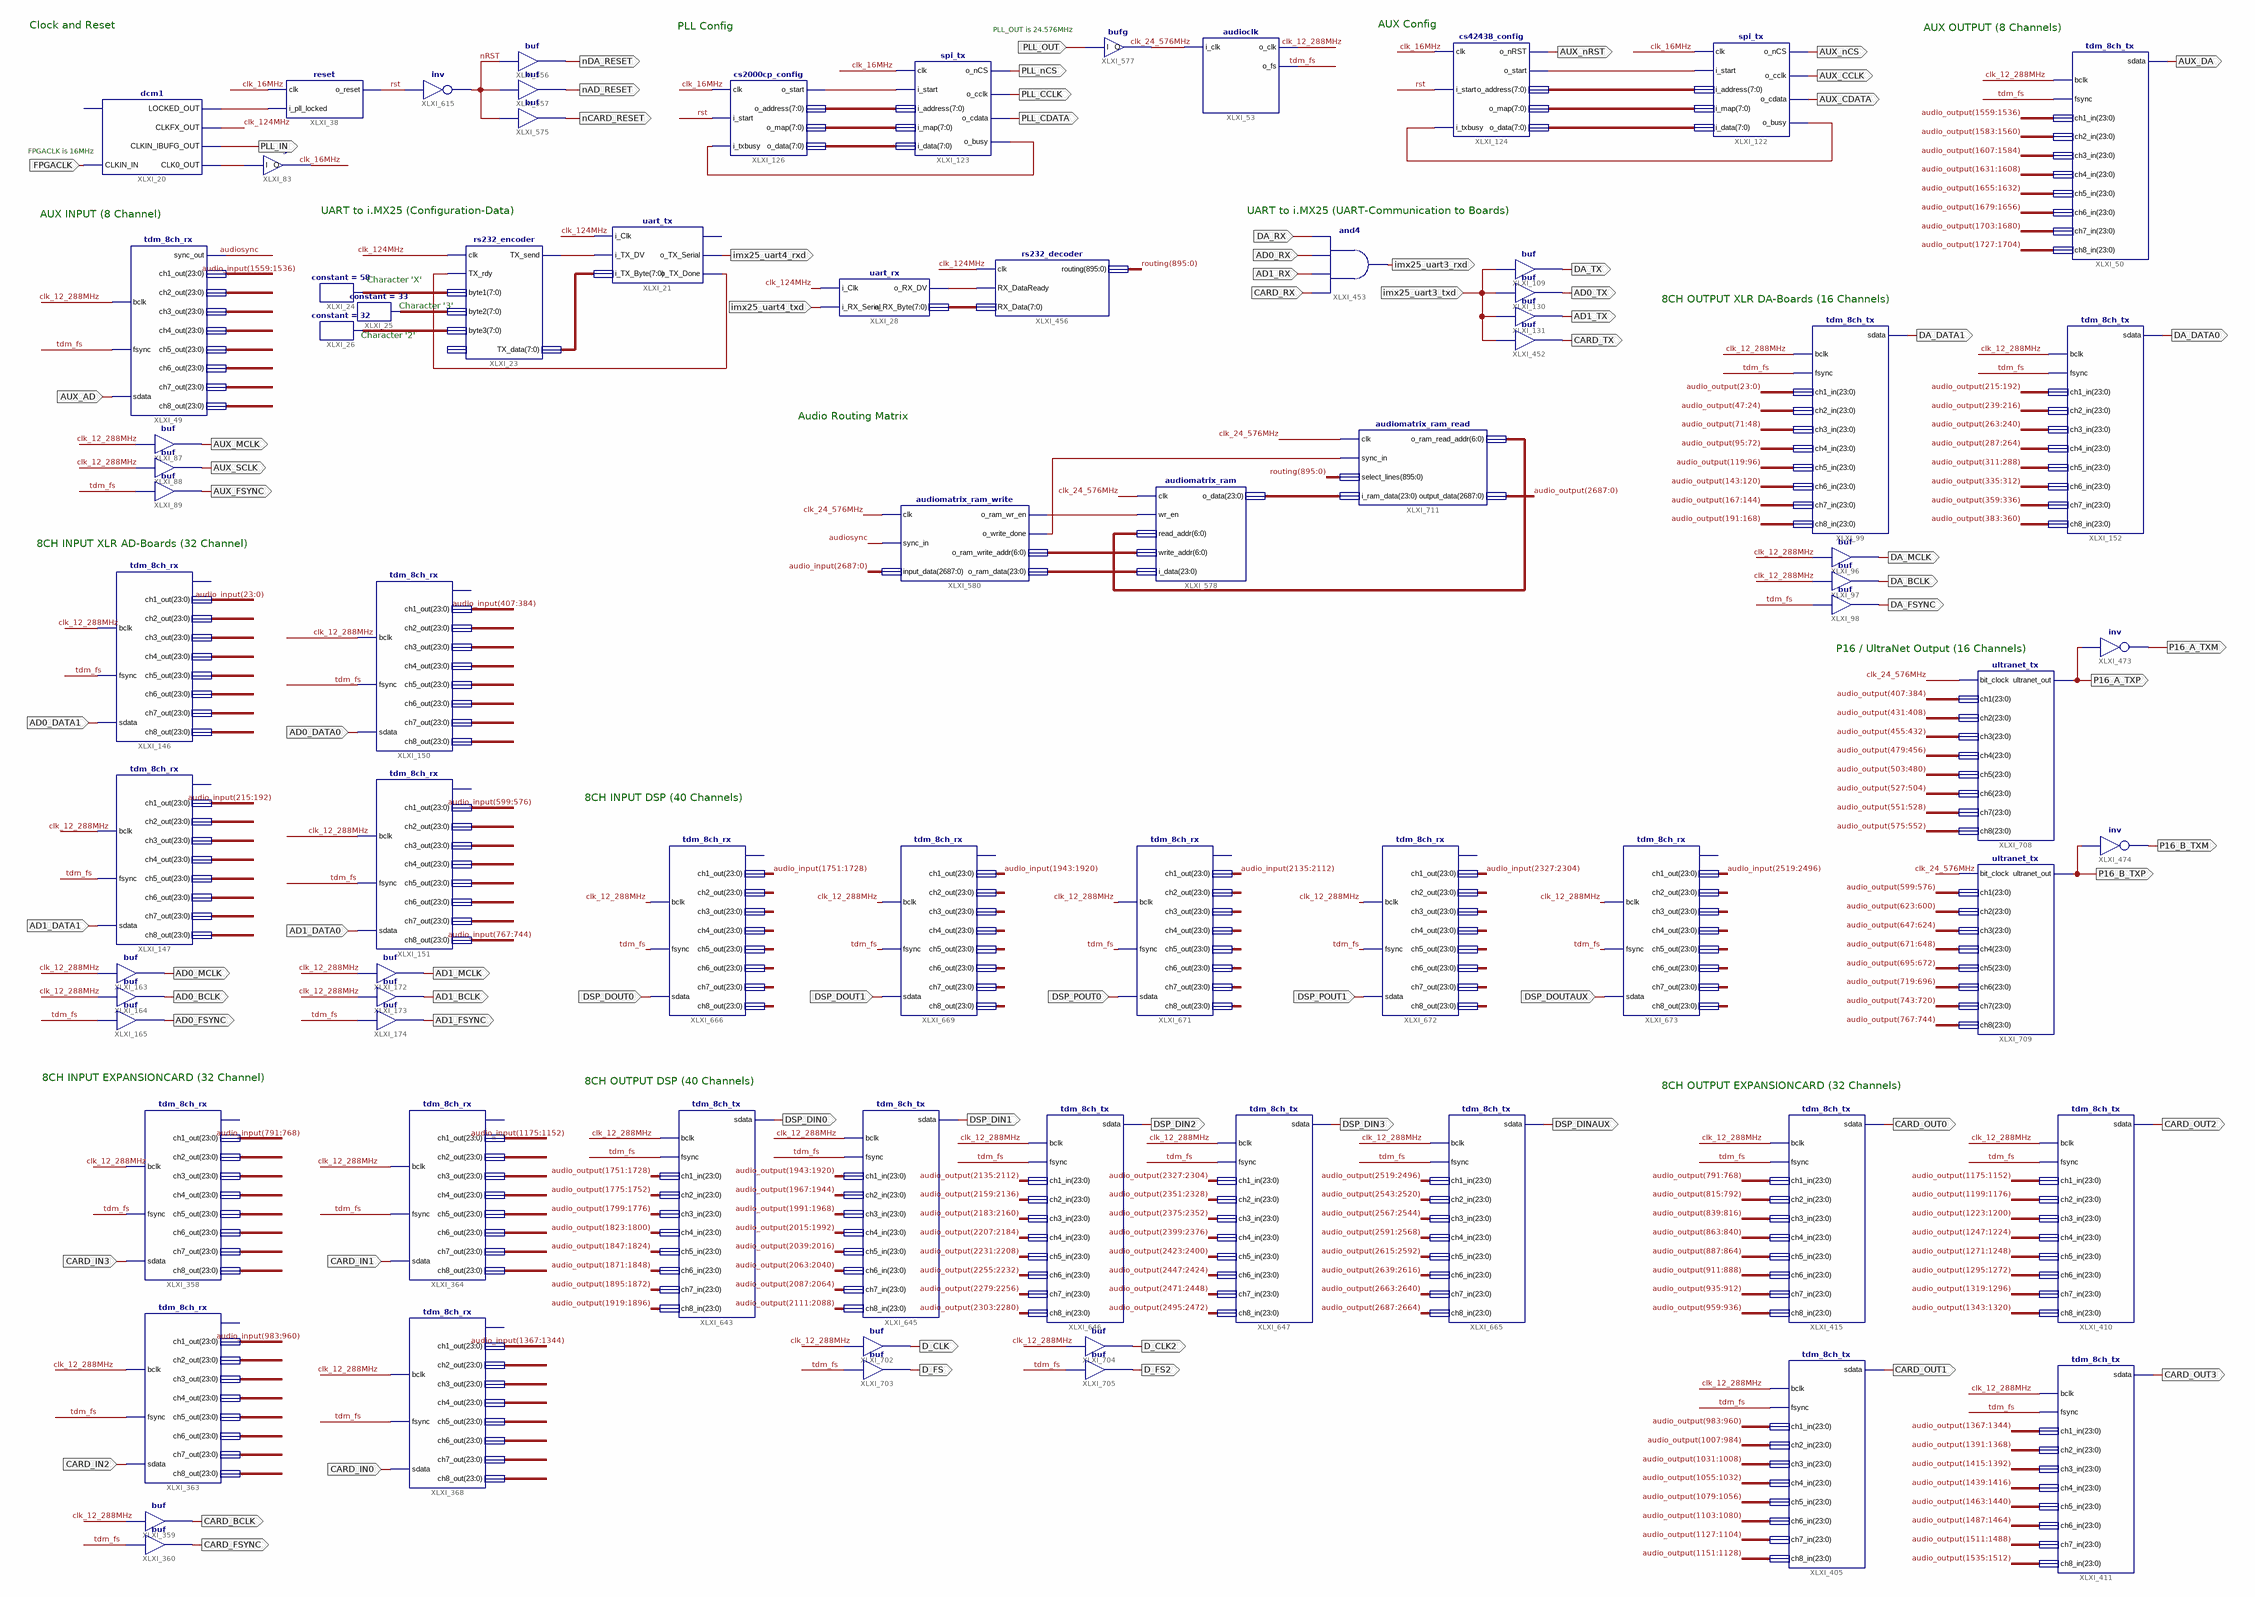
[diagram p0: schematic sheet 1]
// Xilinx ISE schematic main.sch (spartan3a) as structural Verilog: 76 symbols, 73 ports
module main (
  input  FPGACLK,
  input  PLL_OUT,
  input  CARD_IN3,
  input  CARD_IN2,
  input  CARD_IN1,
  input  CARD_IN0,
  input  AD0_DATA1,
  input  AD1_DATA1,
  input  AD0_DATA0,
  input  AD1_DATA0,
  input  imx25_uart4_txd,
  input  DA_RX,
  input  AD0_RX,
  input  AD1_RX,
  input  CARD_RX,
  input  imx25_uart3_txd,
  input  AUX_AD,
  input  DSP_DOUTAUX,
  input  DSP_DOUT0,
  input  DSP_DOUT1,
  input  DSP_POUT0,
  input  DSP_POUT1,
  output PLL_IN,
  output nDA_RESET,
  output nAD_RESET,
  output nCARD_RESET,
  output CARD_OUT0,
  output CARD_OUT1,
  output CARD_OUT2,
  output CARD_OUT3,
  output P16_A_TXP,
  output P16_A_TXM,
  output P16_B_TXP,
  output P16_B_TXM,
  output DA_MCLK,
  output DA_BCLK,
  output DA_FSYNC,
  output DA_DATA1,
  output DA_DATA0,
  output PLL_nCS,
  output PLL_CDATA,
  output PLL_CCLK,
  output AUX_nRST,
  output AUX_nCS,
  output AUX_CCLK,
  output AUX_CDATA,
  output AUX_DA,
  output CARD_BCLK,
  output CARD_FSYNC,
  output AD0_MCLK,
  output AD0_BCLK,
  output AD0_FSYNC,
  output AD1_MCLK,
  output AD1_BCLK,
  output AD1_FSYNC,
  output imx25_uart4_rxd,
  output imx25_uart3_rxd,
  output DA_TX,
  output AD0_TX,
  output AD1_TX,
  output CARD_TX,
  output AUX_MCLK,
  output AUX_SCLK,
  output AUX_FSYNC,
  output DSP_DIN0,
  output DSP_DIN1,
  output DSP_DIN2,
  output DSP_DIN3,
  output DSP_DINAUX,
  output D_CLK,
  output D_FS,
  output D_CLK2,
  output D_FS2
);

  wire audiosync, clk_12_288MHz, clk_16MHz, clk_24_576MHz, clk_124MHz, nRST, rst, tdm_fs, XLXN_50, XLXN_54,
       XLXN_63, XLXN_70, XLXN_222, XLXN_226, XLXN_330, XLXN_346, XLXN_1898, XLXN_2357, XLXN_2487;
  wire [6:0] XLXN_1973, XLXN_2328;
  wire [7:0] XLXN_52, XLXN_55, XLXN_56, XLXN_57, XLXN_62, XLXN_67, XLXN_68, XLXN_69, XLXN_223, XLXN_224,
       XLXN_225;
  wire [23:0] XLXN_1974, XLXN_2309;
  wire [895:0] routing;
  wire [2687:0] audio_input, audio_output;

  dcm1 XLXI_20 (
    .CLKIN_IN(FPGACLK), .LOCKED_OUT(XLXN_2487), .CLKFX_OUT(clk_124MHz), .CLKIN_IBUFG_OUT(PLL_IN),
    .CLK0_OUT(XLXN_330));  // open: RST_IN
  bufg XLXI_83 (.I(XLXN_330), .O(clk_16MHz));
  not XLXI_615 (nRST, rst);
  buf XLXI_556 (nDA_RESET, nRST);
  buf XLXI_557 (nAD_RESET, nRST);
  buf XLXI_575 (nCARD_RESET, nRST);
  tdm_8ch_tx XLXI_415 (
    .bclk(clk_12_288MHz), .fsync(tdm_fs), .ch1_in(audio_output[791:768]), .ch2_in(audio_output[815:792]),
    .ch3_in(audio_output[839:816]), .ch4_in(audio_output[863:840]), .ch5_in(audio_output[887:864]),
    .ch6_in(audio_output[911:888]), .ch7_in(audio_output[935:912]), .ch8_in(audio_output[959:936]),
    .sdata(CARD_OUT0));
  tdm_8ch_tx XLXI_405 (
    .bclk(clk_12_288MHz), .fsync(tdm_fs), .ch1_in(audio_output[983:960]), .ch2_in(audio_output[1007:984]),
    .ch3_in(audio_output[1031:1008]), .ch4_in(audio_output[1055:1032]), .ch5_in(audio_output[1079:1056]),
    .ch6_in(audio_output[1103:1080]), .ch7_in(audio_output[1127:1104]), .ch8_in(audio_output[1151:1128]),
    .sdata(CARD_OUT1));
  tdm_8ch_tx XLXI_410 (
    .bclk(clk_12_288MHz), .fsync(tdm_fs), .ch1_in(audio_output[1175:1152]), .ch2_in(audio_output[1199:1176]),
    .ch3_in(audio_output[1223:1200]), .ch4_in(audio_output[1247:1224]), .ch5_in(audio_output[1271:1248]),
    .ch6_in(audio_output[1295:1272]), .ch7_in(audio_output[1319:1296]), .ch8_in(audio_output[1343:1320]),
    .sdata(CARD_OUT2));
  tdm_8ch_tx XLXI_411 (
    .bclk(clk_12_288MHz), .fsync(tdm_fs), .ch1_in(audio_output[1367:1344]), .ch2_in(audio_output[1391:1368]),
    .ch3_in(audio_output[1415:1392]), .ch4_in(audio_output[1439:1416]), .ch5_in(audio_output[1463:1440]),
    .ch6_in(audio_output[1487:1464]), .ch7_in(audio_output[1511:1488]), .ch8_in(audio_output[1535:1512]),
    .sdata(CARD_OUT3));
  not XLXI_473 (P16_A_TXM, P16_A_TXP);
  not XLXI_474 (P16_B_TXM, P16_B_TXP);
  tdm_8ch_tx XLXI_99 (
    .bclk(clk_12_288MHz), .fsync(tdm_fs), .ch1_in(audio_output[23:0]), .ch2_in(audio_output[47:24]),
    .ch3_in(audio_output[71:48]), .ch4_in(audio_output[95:72]), .ch5_in(audio_output[119:96]),
    .ch6_in(audio_output[143:120]), .ch7_in(audio_output[167:144]), .ch8_in(audio_output[191:168]),
    .sdata(DA_DATA1));
  tdm_8ch_tx XLXI_152 (
    .bclk(clk_12_288MHz), .fsync(tdm_fs), .ch1_in(audio_output[215:192]), .ch2_in(audio_output[239:216]),
    .ch3_in(audio_output[263:240]), .ch4_in(audio_output[287:264]), .ch5_in(audio_output[311:288]),
    .ch6_in(audio_output[335:312]), .ch7_in(audio_output[359:336]), .ch8_in(audio_output[383:360]),
    .sdata(DA_DATA0));
  buf XLXI_96 (DA_MCLK, clk_12_288MHz);
  buf XLXI_97 (DA_BCLK, clk_12_288MHz);
  buf XLXI_98 (DA_FSYNC, tdm_fs);
  reset XLXI_38 (.clk(clk_16MHz), .i_pll_locked(XLXN_2487), .o_reset(rst));
  cs2000cp_config XLXI_126 (
    .clk(clk_16MHz), .i_start(rst), .i_txbusy(XLXN_226), .o_start(XLXN_222), .o_address(XLXN_223),
    .o_map(XLXN_224), .o_data(XLXN_225));
  spi_tx XLXI_123 (
    .clk(clk_16MHz), .i_start(XLXN_222), .i_address(XLXN_223), .i_map(XLXN_224), .i_data(XLXN_225),
    .o_nCS(PLL_nCS), .o_cclk(PLL_CCLK), .o_cdata(PLL_CDATA), .o_busy(XLXN_226));
  bufg XLXI_577 (.I(PLL_OUT), .O(clk_24_576MHz));
  audioclk XLXI_53 (.i_clk(clk_24_576MHz), .o_clk(clk_12_288MHz), .o_fs(tdm_fs));
  spi_tx XLXI_122 (
    .clk(clk_16MHz), .i_start(XLXN_346), .i_address(XLXN_67), .i_map(XLXN_68), .i_data(XLXN_69),
    .o_nCS(AUX_nCS), .o_cclk(AUX_CCLK), .o_cdata(AUX_CDATA), .o_busy(XLXN_70));
  cs42438_config XLXI_124 (
    .clk(clk_16MHz), .i_start(rst), .i_txbusy(XLXN_70), .o_nRST(AUX_nRST), .o_start(XLXN_346),
    .o_address(XLXN_67), .o_map(XLXN_68), .o_data(XLXN_69));
  tdm_8ch_tx XLXI_50 (
    .bclk(clk_12_288MHz), .fsync(tdm_fs), .ch1_in(audio_output[1559:1536]), .ch2_in(audio_output[1583:1560]),
    .ch3_in(audio_output[1607:1584]), .ch4_in(audio_output[1631:1608]), .ch5_in(audio_output[1655:1632]),
    .ch6_in(audio_output[1679:1656]), .ch7_in(audio_output[1703:1680]), .ch8_in(audio_output[1727:1704]),
    .sdata(AUX_DA));
  tdm_8ch_rx XLXI_363 (
    .bclk(clk_12_288MHz), .fsync(tdm_fs), .sdata(CARD_IN2), .ch1_out(audio_input[983:960]),
    .ch2_out(audio_input[1007:984]), .ch3_out(audio_input[1031:1008]), .ch4_out(audio_input[1055:1032]),
    .ch5_out(audio_input[1079:1056]), .ch6_out(audio_input[1103:1080]), .ch7_out(audio_input[1127:1104]),
    .ch8_out(audio_input[1151:1128]));  // open: sync_out
  tdm_8ch_rx XLXI_358 (
    .bclk(clk_12_288MHz), .fsync(tdm_fs), .sdata(CARD_IN3), .ch1_out(audio_input[791:768]),
    .ch2_out(audio_input[815:792]), .ch3_out(audio_input[839:816]), .ch4_out(audio_input[863:840]),
    .ch5_out(audio_input[887:864]), .ch6_out(audio_input[911:888]), .ch7_out(audio_input[935:912]),
    .ch8_out(audio_input[959:936]));  // open: sync_out
  tdm_8ch_rx XLXI_364 (
    .bclk(clk_12_288MHz), .fsync(tdm_fs), .sdata(CARD_IN1), .ch1_out(audio_input[1175:1152]),
    .ch2_out(audio_input[1199:1176]), .ch3_out(audio_input[1223:1200]), .ch4_out(audio_input[1247:1224]),
    .ch5_out(audio_input[1271:1248]), .ch6_out(audio_input[1295:1272]), .ch7_out(audio_input[1319:1296]),
    .ch8_out(audio_input[1343:1320]));  // open: sync_out
  tdm_8ch_rx XLXI_368 (
    .bclk(clk_12_288MHz), .fsync(tdm_fs), .sdata(CARD_IN0), .ch1_out(audio_input[1367:1344]),
    .ch2_out(audio_input[1391:1368]), .ch3_out(audio_input[1415:1392]), .ch4_out(audio_input[1439:1416]),
    .ch5_out(audio_input[1463:1440]), .ch6_out(audio_input[1487:1464]), .ch7_out(audio_input[1511:1488]),
    .ch8_out(audio_input[1535:1512]));  // open: sync_out
  buf XLXI_359 (CARD_BCLK, clk_12_288MHz);
  buf XLXI_360 (CARD_FSYNC, tdm_fs);
  tdm_8ch_rx XLXI_146 (
    .bclk(clk_12_288MHz), .fsync(tdm_fs), .sdata(AD0_DATA1), .ch1_out(audio_input[23:0]),
    .ch2_out(audio_input[47:24]), .ch3_out(audio_input[71:48]), .ch4_out(audio_input[95:72]),
    .ch5_out(audio_input[119:96]), .ch6_out(audio_input[143:120]), .ch7_out(audio_input[167:144]),
    .ch8_out(audio_input[191:168]));  // open: sync_out
  tdm_8ch_rx XLXI_147 (
    .bclk(clk_12_288MHz), .fsync(tdm_fs), .sdata(AD1_DATA1), .ch1_out(audio_input[215:192]),
    .ch2_out(audio_input[239:216]), .ch3_out(audio_input[263:240]), .ch4_out(audio_input[287:264]),
    .ch5_out(audio_input[311:288]), .ch6_out(audio_input[335:312]), .ch7_out(audio_input[359:336]),
    .ch8_out(audio_input[383:360]));  // open: sync_out
  tdm_8ch_rx XLXI_150 (
    .bclk(clk_12_288MHz), .fsync(tdm_fs), .sdata(AD0_DATA0), .ch1_out(audio_input[407:384]),
    .ch2_out(audio_input[431:408]), .ch3_out(audio_input[455:432]), .ch4_out(audio_input[479:456]),
    .ch5_out(audio_input[503:480]), .ch6_out(audio_input[527:504]), .ch7_out(audio_input[551:528]),
    .ch8_out(audio_input[575:552]));  // open: sync_out
  tdm_8ch_rx XLXI_151 (
    .bclk(clk_12_288MHz), .fsync(tdm_fs), .sdata(AD1_DATA0), .ch1_out(audio_input[599:576]),
    .ch2_out(audio_input[623:600]), .ch3_out(audio_input[647:624]), .ch4_out(audio_input[671:648]),
    .ch5_out(audio_input[695:672]), .ch6_out(audio_input[719:696]), .ch7_out(audio_input[743:720]),
    .ch8_out(audio_input[767:744]));  // open: sync_out
  buf XLXI_163 (AD0_MCLK, clk_12_288MHz);
  buf XLXI_164 (AD0_BCLK, clk_12_288MHz);
  buf XLXI_165 (AD0_FSYNC, tdm_fs);
  buf XLXI_172 (AD1_MCLK, clk_12_288MHz);
  buf XLXI_173 (AD1_BCLK, clk_12_288MHz);
  buf XLXI_174 (AD1_FSYNC, tdm_fs);
  rs232_encoder XLXI_23 (
    .clk(clk_124MHz), .TX_rdy(XLXN_54), .byte1(XLXN_55), .byte2(XLXN_56), .byte3(XLXN_57), .TX_send(XLXN_50),
    .TX_data(XLXN_52));  // open: byte4
  uart_tx XLXI_21 (
    .i_Clk(clk_124MHz), .i_TX_DV(XLXN_50), .i_TX_Byte(XLXN_52), .o_TX_Serial(imx25_uart4_rxd),
    .o_TX_Done(XLXN_54));  // open: o_TX_Active
  constant #(.CValue("33")) XLXI_25 (.O(XLXN_56));
  constant #(.CValue("58")) XLXI_24 (.O(XLXN_55));
  constant #(.CValue("32")) XLXI_26 (.O(XLXN_57));
  uart_rx XLXI_28 (.i_Clk(clk_124MHz), .i_RX_Serial(imx25_uart4_txd), .o_RX_DV(XLXN_63), .o_RX_Byte(XLXN_62));
  rs232_decoder XLXI_456 (.clk(clk_124MHz), .RX_DataReady(XLXN_63), .RX_Data(XLXN_62), .routing(routing));
  and XLXI_453 (imx25_uart3_rxd, CARD_RX, AD1_RX, AD0_RX, DA_RX);
  buf XLXI_130 (AD0_TX, imx25_uart3_txd);
  buf XLXI_131 (AD1_TX, imx25_uart3_txd);
  buf XLXI_109 (DA_TX, imx25_uart3_txd);
  buf XLXI_452 (CARD_TX, imx25_uart3_txd);
  tdm_8ch_rx XLXI_49 (
    .bclk(clk_12_288MHz), .fsync(tdm_fs), .sdata(AUX_AD), .sync_out(audiosync),
    .ch1_out(audio_input[1559:1536]), .ch2_out(audio_input[1583:1560]), .ch3_out(audio_input[1607:1584]),
    .ch4_out(audio_input[1631:1608]), .ch5_out(audio_input[1655:1632]), .ch6_out(audio_input[1679:1656]),
    .ch7_out(audio_input[1703:1680]), .ch8_out(audio_input[1727:1704]));
  buf XLXI_87 (AUX_MCLK, clk_12_288MHz);
  buf XLXI_88 (AUX_SCLK, clk_12_288MHz);
  buf XLXI_89 (AUX_FSYNC, tdm_fs);
  tdm_8ch_rx XLXI_673 (
    .bclk(clk_12_288MHz), .fsync(tdm_fs), .sdata(DSP_DOUTAUX), .ch1_out(audio_input[2519:2496]),
    .ch2_out(audio_input[2543:2520]), .ch3_out(audio_input[2567:2544]), .ch4_out(audio_input[2591:2568]),
    .ch5_out(audio_input[2615:2592]), .ch6_out(audio_input[2639:2616]), .ch7_out(audio_input[2663:2640]),
    .ch8_out(audio_input[2687:2664]));  // open: sync_out
  tdm_8ch_rx XLXI_666 (
    .bclk(clk_12_288MHz), .fsync(tdm_fs), .sdata(DSP_DOUT0), .ch1_out(audio_input[1751:1728]),
    .ch2_out(audio_input[1775:1752]), .ch3_out(audio_input[1799:1776]), .ch4_out(audio_input[1823:1800]),
    .ch5_out(audio_input[1847:1824]), .ch6_out(audio_input[1871:1848]), .ch7_out(audio_input[1895:1872]),
    .ch8_out(audio_input[1919:1896]));  // open: sync_out
  tdm_8ch_rx XLXI_669 (
    .bclk(clk_12_288MHz), .fsync(tdm_fs), .sdata(DSP_DOUT1), .ch1_out(audio_input[1943:1920]),
    .ch2_out(audio_input[1967:1944]), .ch3_out(audio_input[1991:1968]), .ch4_out(audio_input[2015:1992]),
    .ch5_out(audio_input[2039:2016]), .ch6_out(audio_input[2063:2040]), .ch7_out(audio_input[2087:2064]),
    .ch8_out(audio_input[2111:2088]));  // open: sync_out
  tdm_8ch_rx XLXI_671 (
    .bclk(clk_12_288MHz), .fsync(tdm_fs), .sdata(DSP_POUT0), .ch1_out(audio_input[2135:2112]),
    .ch2_out(audio_input[2159:2136]), .ch3_out(audio_input[2183:2160]), .ch4_out(audio_input[2207:2184]),
    .ch5_out(audio_input[2231:2208]), .ch6_out(audio_input[2255:2232]), .ch7_out(audio_input[2279:2256]),
    .ch8_out(audio_input[2303:2280]));  // open: sync_out
  tdm_8ch_rx XLXI_672 (
    .bclk(clk_12_288MHz), .fsync(tdm_fs), .sdata(DSP_POUT1), .ch1_out(audio_input[2327:2304]),
    .ch2_out(audio_input[2351:2328]), .ch3_out(audio_input[2375:2352]), .ch4_out(audio_input[2399:2376]),
    .ch5_out(audio_input[2423:2400]), .ch6_out(audio_input[2447:2424]), .ch7_out(audio_input[2471:2448]),
    .ch8_out(audio_input[2495:2472]));  // open: sync_out
  tdm_8ch_tx XLXI_643 (
    .bclk(clk_12_288MHz), .fsync(tdm_fs), .ch1_in(audio_output[1751:1728]), .ch2_in(audio_output[1775:1752]),
    .ch3_in(audio_output[1799:1776]), .ch4_in(audio_output[1823:1800]), .ch5_in(audio_output[1847:1824]),
    .ch6_in(audio_output[1871:1848]), .ch7_in(audio_output[1895:1872]), .ch8_in(audio_output[1919:1896]),
    .sdata(DSP_DIN0));
  tdm_8ch_tx XLXI_645 (
    .bclk(clk_12_288MHz), .fsync(tdm_fs), .ch1_in(audio_output[1943:1920]), .ch2_in(audio_output[1967:1944]),
    .ch3_in(audio_output[1991:1968]), .ch4_in(audio_output[2015:1992]), .ch5_in(audio_output[2039:2016]),
    .ch6_in(audio_output[2063:2040]), .ch7_in(audio_output[2087:2064]), .ch8_in(audio_output[2111:2088]),
    .sdata(DSP_DIN1));
  tdm_8ch_tx XLXI_646 (
    .bclk(clk_12_288MHz), .fsync(tdm_fs), .ch1_in(audio_output[2135:2112]), .ch2_in(audio_output[2159:2136]),
    .ch3_in(audio_output[2183:2160]), .ch4_in(audio_output[2207:2184]), .ch5_in(audio_output[2231:2208]),
    .ch6_in(audio_output[2255:2232]), .ch7_in(audio_output[2279:2256]), .ch8_in(audio_output[2303:2280]),
    .sdata(DSP_DIN2));
  tdm_8ch_tx XLXI_647 (
    .bclk(clk_12_288MHz), .fsync(tdm_fs), .ch1_in(audio_output[2327:2304]), .ch2_in(audio_output[2351:2328]),
    .ch3_in(audio_output[2375:2352]), .ch4_in(audio_output[2399:2376]), .ch5_in(audio_output[2423:2400]),
    .ch6_in(audio_output[2447:2424]), .ch7_in(audio_output[2471:2448]), .ch8_in(audio_output[2495:2472]),
    .sdata(DSP_DIN3));
  tdm_8ch_tx XLXI_665 (
    .bclk(clk_12_288MHz), .fsync(tdm_fs), .ch1_in(audio_output[2519:2496]), .ch2_in(audio_output[2543:2520]),
    .ch3_in(audio_output[2567:2544]), .ch4_in(audio_output[2591:2568]), .ch5_in(audio_output[2615:2592]),
    .ch6_in(audio_output[2639:2616]), .ch7_in(audio_output[2663:2640]), .ch8_in(audio_output[2687:2664]),
    .sdata(DSP_DINAUX));
  buf XLXI_702 (D_CLK, clk_12_288MHz);
  buf XLXI_703 (D_FS, tdm_fs);
  buf XLXI_704 (D_CLK2, clk_12_288MHz);
  buf XLXI_705 (D_FS2, tdm_fs);
  audiomatrix_ram_write XLXI_580 (
    .clk(clk_24_576MHz), .sync_in(audiosync), .input_data(audio_input), .o_ram_wr_en(XLXN_1898),
    .o_write_done(XLXN_2357), .o_ram_write_addr(XLXN_1973), .o_ram_data(XLXN_1974));
  audiomatrix_ram XLXI_578 (
    .clk(clk_24_576MHz), .wr_en(XLXN_1898), .read_addr(XLXN_2328), .write_addr(XLXN_1973),
    .i_data(XLXN_1974), .o_data(XLXN_2309));
  ultranet_tx XLXI_708 (
    .bit_clock(clk_24_576MHz), .ch1(audio_output[407:384]), .ch2(audio_output[431:408]),
    .ch3(audio_output[455:432]), .ch4(audio_output[479:456]), .ch5(audio_output[503:480]),
    .ch6(audio_output[527:504]), .ch7(audio_output[551:528]), .ch8(audio_output[575:552]),
    .ultranet_out(P16_A_TXP));
  ultranet_tx XLXI_709 (
    .bit_clock(clk_24_576MHz), .ch1(audio_output[599:576]), .ch2(audio_output[623:600]),
    .ch3(audio_output[647:624]), .ch4(audio_output[671:648]), .ch5(audio_output[695:672]),
    .ch6(audio_output[719:696]), .ch7(audio_output[743:720]), .ch8(audio_output[767:744]),
    .ultranet_out(P16_B_TXP));
  audiomatrix_ram_read XLXI_711 (
    .clk(clk_24_576MHz), .sync_in(XLXN_2357), .select_lines(routing), .i_ram_data(XLXN_2309),
    .o_ram_read_addr(XLXN_2328), .output_data(audio_output));

  // Notes on the sheet:
  //   AUX Config
  //   Clock and Reset
  //   PLL Config
  //   AUX OUTPUT (8 Channels)
  //   PLL_OUT is 24.576MHz
  //   FPGACLK is 16MHz
  //   UART to i.MX25 (Configuration-Data)
  //   UART to i.MX25 (UART-Communication to Boards)
  //   AUX INPUT (8 Channel)
  //   Character 'X'
  //   8CH OUTPUT XLR DA-Boards (16 Channels)
  //   Character '3'
  //   Character '2'
  //   Audio Routing Matrix
  //   8CH INPUT XLR AD-Boards (32 Channel)
  //   P16 / UltraNet Output (16 Channels)
  //   8CH INPUT DSP (40 Channels)
  //   8CH INPUT EXPANSIONCARD (32 Channel)
  //   8CH OUTPUT DSP (40 Channels)
  //   8CH OUTPUT EXPANSIONCARD (32 Channels)
endmodule
